# EAGLE design gospboard-v3 (EAGLE 8.7.1)
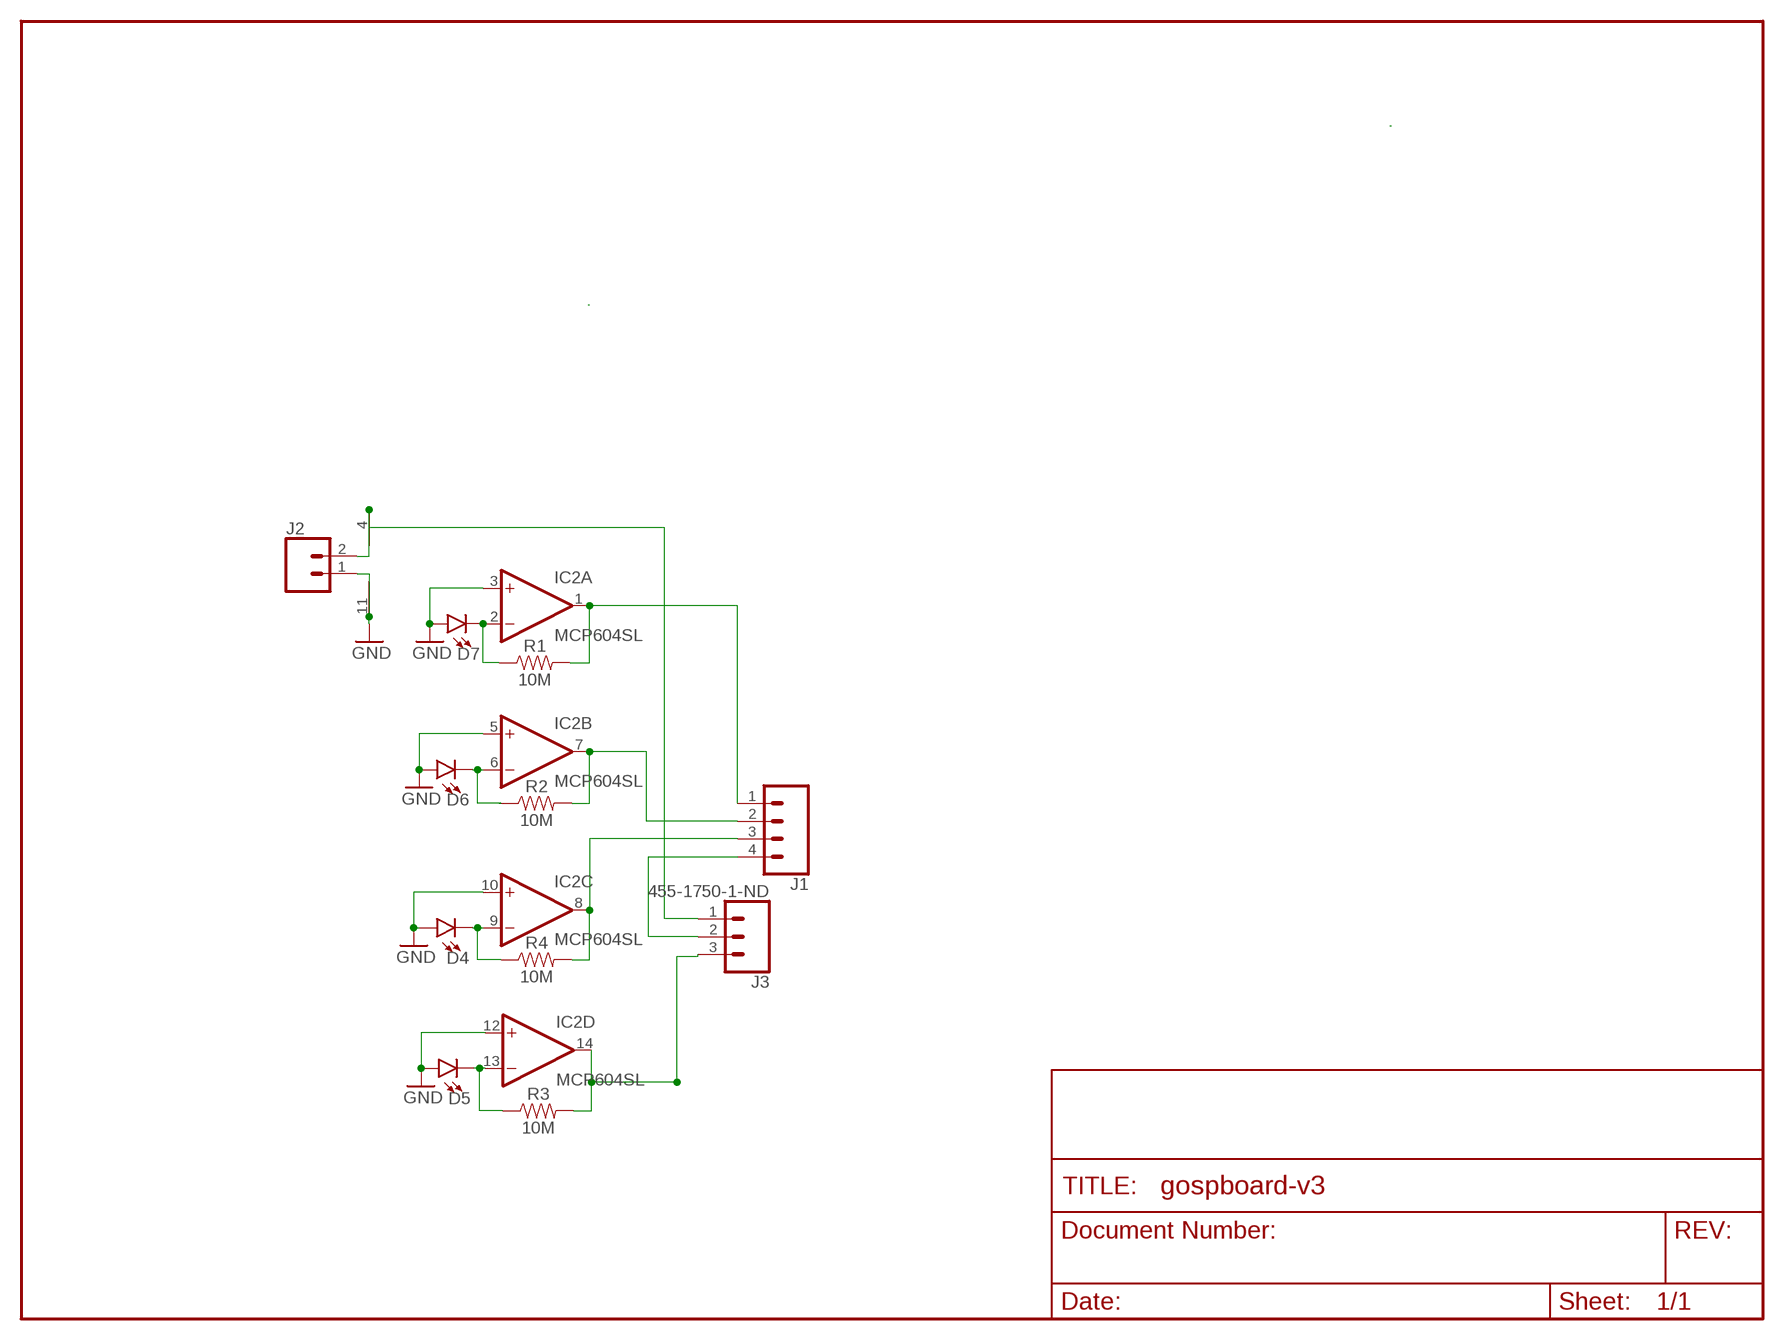
[diagram p0: schematic, sheet 1]

## Parts
D4  LED3MM  [LED_3MM]
D5  LED3MM  [LED_3MM]
D6  LED3MM  [LED_3MM]
D7  LED3MM  [LED_3MM]
IC2  MCP604SL  [SO14]
J1  CONN_04  [1X04]
J2  CONN_02  [1X02]
J3  455-1750-1-ND  CONN_03  [1X03]
R1  10M  1MOHM-0603-1/4W-5%  [0603]
R2  10M  1MOHM-0603-1/4W-5%  [0603]
R3  10M  1MOHM-0603-1/4W-5%  [0603]
R4  10M  1MOHM-0603-1/4W-5%  [0603]

## Nets
ENABLE: IC2.14(D:OUT) J3.3 R3.2
GND: D4.A D5.A D6.A D7.A IC2.3(A:+IN) IC2.5(B:+IN) IC2.10(C:+IN) IC2.11(P:V-) IC2.12(D:+IN) J2.1
N$5: J1.4 J3.2
N$6: D7.K(C) IC2.2(A:-IN) R1.1
N$8: IC2.8(C:OUT) J1.3 R4.2
N$9: D6.K(C) IC2.6(B:-IN) R2.1
N$10: D4.K(C) IC2.9(C:-IN) R4.1
N$11: IC2.7(B:OUT) J1.2 R2.2
N$13: D5.K(C) IC2.13(D:-IN) R3.1
N$14: IC2.4(P:V+) J2.2 J3.1
PIN1: IC2.1(A:OUT) J1.1 R1.2

## Library data of the parts
D4-D7 = SparkFun-LED:LED: LED (Generic) Standard schematic elements and footprints for 5mm, 3mm, 1206, and 0603 sized LEDs. Generic LEDs with no color specified.; PROD_ID: DIO-08794
IC2 = linear:MCP604: Quad Op Amp 2.7V to 6.0V Single Supply CMOS Source: http://ww1.microchip.com/downloads/en/DeviceDoc/21314g.pdf
J1 = SparkFun-Connectors:CONN_04: Multi connection point. Often used as Generic Header-pin footprint for 0.1 inch spaced/style header connections On any of the 0.1 inch spaced packages, you can populate with these: Break Away Headers - Straight <https://www.sparkfun.com/products/116> (PRT-00116) Break Away Male Headers - Right Angle <https://www.sparkfun.com/products/553> (PRT-00553) Female Headers <https://www.sparkfun.com/products/115> (PRT-00115) Break Away Headers - Machine Pin <https://www.sparkfun.com/products/117> (PRT-00117) Break Away Female Headers - Swiss Machine Pin <https://www.sparkfun.com/products/743> (PRT-00743) For SCREWTERMINALS and SPRING TERMINALS visit here: Screw Terimnals on SparkFun.com <https://www.sparkfun.com/search/results?term=Screw+Terminals> (5mm/3.5mm/2.54mm spacing) This device is also useful as a general connection point to wire up your design to another part of your project. Our various solder wires solder well into these plated through hole pads. Hook-Up Wire - Assortment (Stranded, 22 AWG) <https://www.sparkfun.com/products/11375> (PRT-11375) Hook-Up Wire - Assortment (Solid Core, 22 AWG) <https://www.sparkfun.com/products/11367> (PRT-11367) View the entire wire category on our website here <https://www.sparkfun.com/categories/141> Special notes: Molex polarized connector foot print use with SKU : PRT-08231 with associated crimp pins and housings. 1MM SMD Version SKU: PRT-10208; PROD_ID: CONN-09696
J2 = SparkFun-Connectors:CONN_02: Multi connection point. Often used as Generic Header-pin footprint for 0.1 inch spaced/style header connections On any of the 0.1 inch spaced packages, you can populate with these: Break Away Headers - Straight <https://www.sparkfun.com/products/116> (PRT-00116) Break Away Male Headers - Right Angle <https://www.sparkfun.com/products/553> (PRT-00553) Female Headers <https://www.sparkfun.com/products/115> (PRT-00115) Break Away Headers - Machine Pin <https://www.sparkfun.com/products/117> (PRT-00117) Break Away Female Headers - Swiss Machine Pin <https://www.sparkfun.com/products/743> (PRT-00743) For SCREWTERMINALS and SPRING TERMINALS visit here: Screw Terimnals on SparkFun.com <https://www.sparkfun.com/search/results?term=Screw+Terminals> (5mm/3.5mm/2.54mm spacing) This device is also useful as a general connection point to wire up your design to another part of your project. Our various solder wires solder well into these plated through hole pads. Hook-Up Wire - Assortment (Stranded, 22 AWG) <https://www.sparkfun.com/products/11375> (PRT-11375) Hook-Up Wire - Assortment (Solid Core, 22 AWG) <https://www.sparkfun.com/products/11367> (PRT-11367) View the entire wire category on our website here <https://www.sparkfun.com/categories/141> Special notes: Molex polarized connector foot print use with: PRT-08233 with associated crimp pins and housings. 2.54_SCREWTERM for use with PRT-10571. 3.5mm Screw Terminal footprints for PRT-08084 5mm Screw Terminal footprints for use with PRT-08432
J3 = SparkFun-Connectors:CONN_03: Multi connection point. Often used as Generic Header-pin footprint for 0.1 inch spaced/style header connections On any of the 0.1 inch spaced packages, you can populate with these: Break Away Headers - Straight <https://www.sparkfun.com/products/116> (PRT-00116) Break Away Male Headers - Right Angle <https://www.sparkfun.com/products/553> (PRT-00553) Female Headers <https://www.sparkfun.com/products/115> (PRT-00115) Break Away Headers - Machine Pin <https://www.sparkfun.com/products/117> (PRT-00117) Break Away Female Headers - Swiss Machine Pin <https://www.sparkfun.com/products/743> (PRT-00743) Stackable Header - 3 Pin (Female, 0.1") <https://www.sparkfun.com/products/13875> (PRT-13875) For SCREWTERMINALS and SPRING TERMINALS visit here: Screw Terimnals on SparkFun.com <https://www.sparkfun.com/search/results?term=Screw+Terminals> (5mm/3.5mm/2.54mm spacing) This device is also useful as a general connection point to wire up your design to another part of your project. Our various solder wires solder well into these plated through hole pads. Hook-Up Wire - Assortment (Stranded, 22 AWG) <https://www.sparkfun.com/products/11375> (PRT-11375) Hook-Up Wire - Assortment (Solid Core, 22 AWG) <https://www.sparkfun.com/products/11367> (PRT-11367) View the entire wire category on our website here <https://www.sparkfun.com/categories/141> Special notes: Molex polarized connector foot print use with SKU : PRT-08232 with associated crimp pins and housings.; PROD_ID: XXX-00000
R1-R4 = SparkFun-Resistors:1MOHM: 1MΩ resistor A resistor is a passive two-terminal electrical component that implements electrical resistance as a circuit element. Resistors act to reduce current flow, and, at the same time, act to lower voltage levels within circuits. - Wikipedia; PROD_ID: RES-07868; VALUE: 1M

## Net classes
0 default: width 0.203 mm
1 vcc: width 0.254 mm

## Board
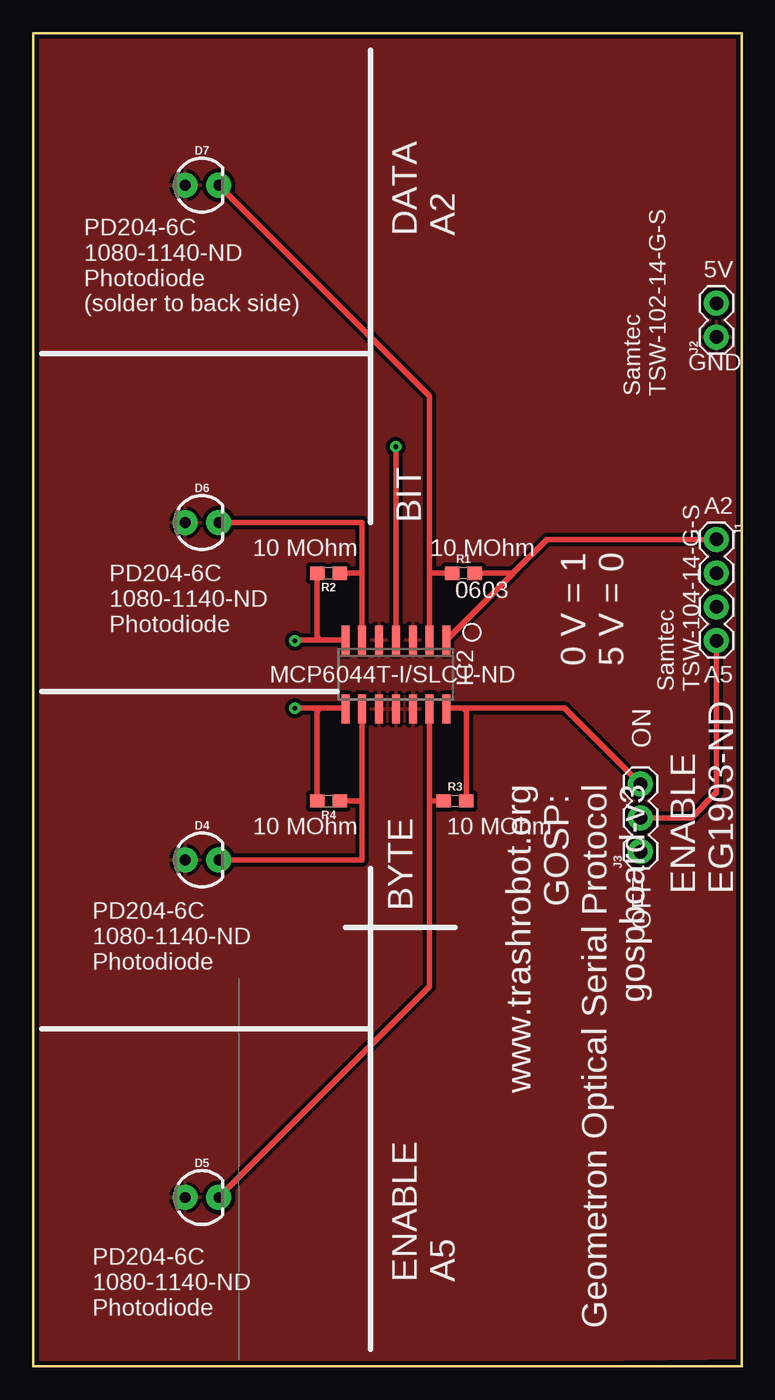
[diagram p1: board, top side]
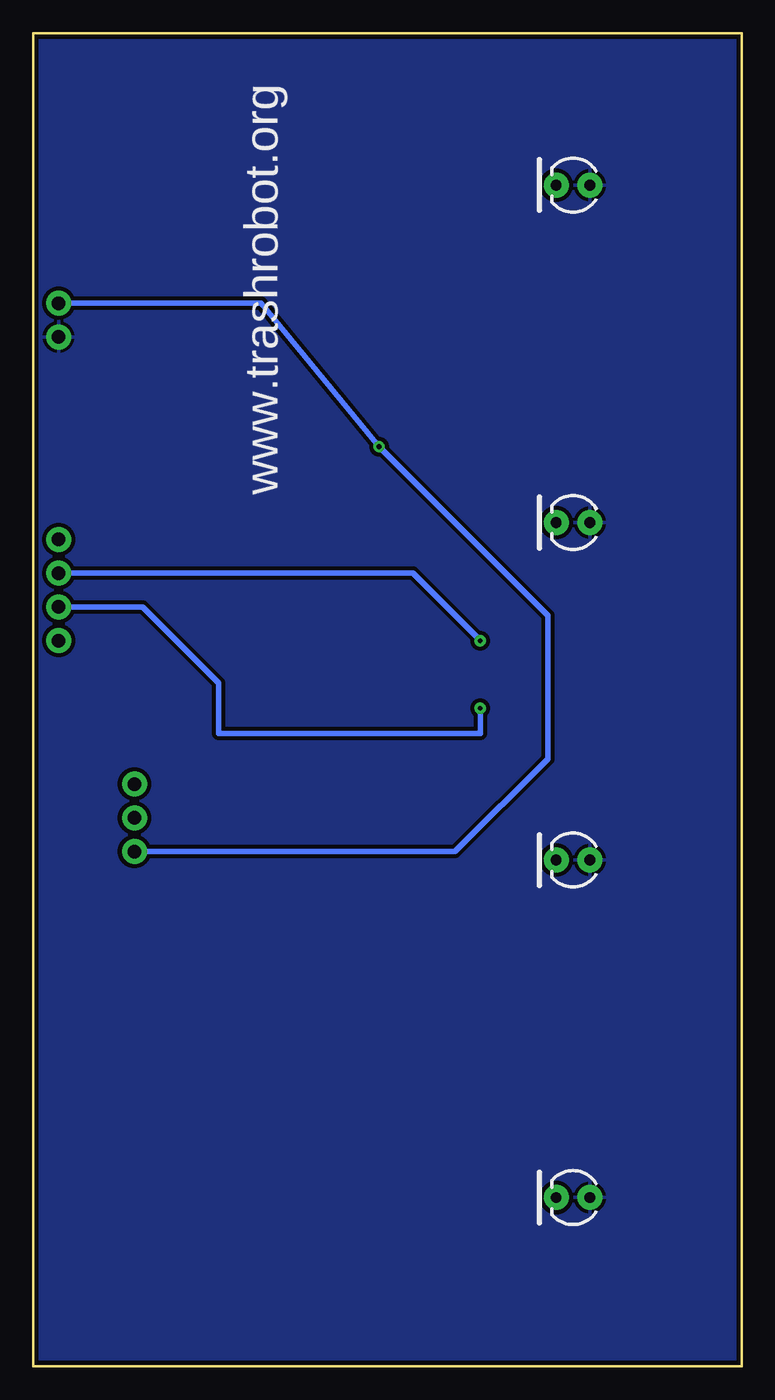
[diagram p2: board, bottom side, seen from below]

Size 53.34 x 100.33 mm. Coordinates in mm from the lower left corner, seen from the top.
Outline: 0,100.33 0,0 53.34,0 53.34,100.33 0,100.33
Copper layers (1*16): Top 0.035mm / dielectric 1.5mm / Bottom 0.035mm
Design rules "SparkFun": minimum track width 8mil, minimum drill 20mil, track to track 8mil, track to pad 8mil, pad to pad 8mil, via to via 8mil, smd to smd 8mil, copper to edge 10mil, drill to drill 8mil, minimum pad ring 12mil, minimum via ring 10mil, stop-mask expansion 4mil, vias tented up to drill 25mil, thermal gap 10mil

### Footprints (pad centres in the part's own frame; a part is rotated, then mirrored left to right if it is on the bottom)
LED_3MM = drill 0.813 pad 1.88: A -1.27,0; K 1.27,0
SO14 = smd 0.6 x 2.2: 1 -3.81,-2.6; 2 -2.54,-2.6; 3 -1.27,-2.6; 4 0,-2.6; 5 1.27,-2.6; 6 2.54,-2.6; 7 3.81,-2.6; 8 3.81,2.6; 9 2.54,2.6; 10 1.27,2.6; 11 0,2.6; 12 -1.27,2.6; 13 -2.54,2.6; 14 -3.81,2.6
1X04 = drill 1.016 pad 1.88: 1 0,0; 2 2.54,0; 3 5.08,0; 4 7.62,0
1X02 = drill 1.016 pad 1.88: 1 0,0; 2 2.54,0
1X03 = drill 1.016 pad 1.88: 1 0,0; 2 2.54,0; 3 5.08,0
0603 = smd 1.1 x 1: 1 -0.85,0; 2 0.85,0

### Placement (x,y rotation side)
D4  12.7,38.1 0 top
D5  12.7,12.7 0 top
D6  12.7,63.5 0 top
D7  12.7,88.9 0 top
IC2  27.3,52.07 180 top
J1  51.44,62.23 270 top
J2  51.44,77.47 90 top
J3  45.72,38.73 90 top
R1  32.38,59.69 0 top
R2  22.23,59.69 180 top
R3  31.75,42.55 0 top
R4  22.23,42.55 180 top

### Tracks (layer width: path | path; a pad name or v marks a point on that pad's centre or on a via)
ENABLE
  Top 0.406: 32.38,49.53 31.18,49.53 IC2.14 | R3.2 32.6,49.31 32.38,49.53 | J3.3 40.01,49.53 32.38,49.53
GND
  pour Top (isolate 0.305): 0,100.33 53.34,100.33 53.98,0.64 0,0
  pour Bottom (isolate 0.305): 0,100.33 53.34,100.33 54.61,0 0,0
N$5
  Top 0.406: J3.2 49.53,41.27 51.44,43.18 J1.4
N$6
  Top 0.406: IC2.2 29.84,59.69 | 29.84,59.69 29.84,73.03 D7.K | R1.1 29.84,59.69
N$8  (via drill 0.35)
  Top 0.406: IC2.8 23.43,49.53 21.59,49.53 | 21.59,49.53 v19.68,49.53 | R4.2 21.38,49.31 21.59,49.53
  Bottom 0.406: v19.68,49.53 19.68,47.62 39.37,47.62 39.37,51.44 45.09,57.15 J1.3
N$9
  Top 0.406: IC2.6 24.77,59.69 | 24.77,59.69 24.77,63.5 D6.K | R2.1 24.77,59.69
N$10
  Top 0.406: IC2.9 24.77,42.55 | 24.77,42.55 24.77,38.1 D4.K | R4.1 24.77,42.55
N$11  (via drill 0.35)
  Top 0.406: IC2.7 21.59,54.67 | 21.59,54.67 19.75,54.67 v19.68,54.61 | R2.2 21.38,54.88 21.59,54.67
  Bottom 0.406: v19.68,54.61 24.77,59.69 J1.2
N$13
  Top 0.406: 29.84,42.55 29.84,28.57 D5.K | 29.84,42.55 IC2.13 | R3.1 29.84,42.55
N$14  (via drill 0.35)
  Top 0.406: IC2.4 v27.3,69.22
  Bottom 0.406: J2.2 36.2,80.01 v27.3,69.22 14.61,56.52 14.61,45.72 21.59,38.73 J3.1
PIN1
  Top 0.406: J1.1 38.67,62.23 36.16,59.72 36.13,59.69 | 36.13,59.69 IC2.1 | R1.2 36.13,59.69

### Text on the board
tPlace: DATA / A2 | 5V | PD204-6C / 1080-1140-ND / Photodiode / (solder to back side) | GND | Samtec / TSW-102-14-G-S | A2 | BIT | 10 MOhm | 10 MOhm | 0603 | PD204-6C / 1080-1140-ND / Photodiode | 0 V = 1 / 5 V = 0 | A5 | MCP6044T-I/SLCT-ND | Samtec / TSW-104-14-G-S | ON | www.trashrobot.org / GOSP: / Geometron Optical Serial Protocol / gospboard-v3 | 10 MOhm | 10 MOhm | OFF | ENABLE / EG1903-ND | BYTE | PD204-6C / 1080-1140-ND / Photodiode | ENABLE / A5 | PD204-6C / 1080-1140-ND / Photodiode
bPlace: www.trashrobot.org
tValues: Tent Vias! | Arduino Wee v1.3